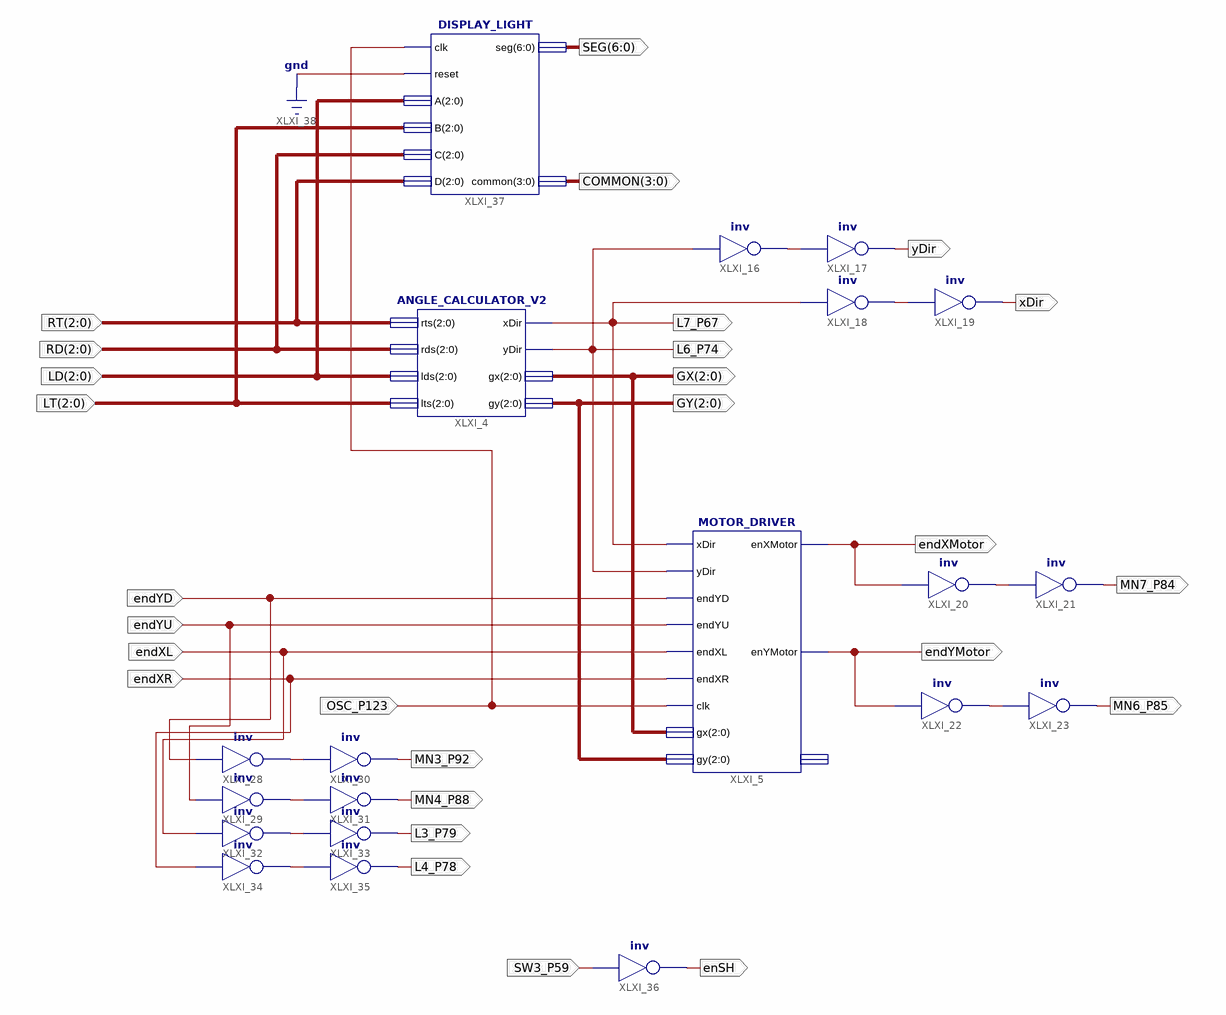
[diagram p0: schematic sheet 1]
// Xilinx ISE schematic main.sch (spartan6) as structural Verilog: 20 symbols, 27 ports
module main (
  input  [2:0] RT,
  input  [2:0] RD,
  input  [2:0] LD,
  input  [2:0] LT,
  input  OSC_P123,
  input  endYU,
  input  endXL,
  input  endXR,
  input  endYD,
  input  SW3_P59,
  output L7_P67,
  output L6_P74,
  output [2:0] GX,
  output [2:0] GY,
  output endXMotor,
  output endYMotor,
  output yDir,
  output xDir,
  output MN7_P84,
  output MN6_P85,
  output MN3_P92,
  output MN4_P88,
  output L3_P79,
  output L4_P78,
  output enSH,
  output [6:0] SEG,
  output [3:0] COMMON
);

  wire XLXN_35, XLXN_36, XLXN_37, XLXN_38, XLXN_50, XLXN_51, XLXN_52, XLXN_53;

  ANGLE_CALCULATOR_V2 XLXI_4 (.rts(RT), .rds(RD), .lds(LD), .lts(LT), .xDir(L7_P67), .yDir(L6_P74), .gx(GX), .gy(GY));
  MOTOR_DRIVER XLXI_5 (
    .xDir(L7_P67), .yDir(L6_P74), .endYD(endYD), .endYU(endYU), .endXL(endXL), .endXR(endXR), .clk(OSC_P123),
    .gx(GX), .gy(GY), .enXMotor(endXMotor), .enYMotor(endYMotor));  // open: st
  not XLXI_16 (XLXN_35, L6_P74);
  not XLXI_17 (yDir, XLXN_35);
  not XLXI_18 (XLXN_36, L7_P67);
  not XLXI_19 (xDir, XLXN_36);
  not XLXI_20 (XLXN_37, endXMotor);
  not XLXI_21 (MN7_P84, XLXN_37);
  not XLXI_22 (XLXN_38, endYMotor);
  not XLXI_23 (MN6_P85, XLXN_38);
  not XLXI_28 (XLXN_50, endYD);
  not XLXI_29 (XLXN_51, endYU);
  not XLXI_30 (MN3_P92, XLXN_50);
  not XLXI_31 (MN4_P88, XLXN_51);
  not XLXI_32 (XLXN_52, endXL);
  not XLXI_33 (L3_P79, XLXN_52);
  not XLXI_34 (XLXN_53, endXR);
  not XLXI_35 (L4_P78, XLXN_53);
  not XLXI_36 (enSH, SW3_P59);
  DISPLAY_LIGHT XLXI_37 (.clk(OSC_P123), .reset(1'b0), .A(LD), .B(LT), .C(RD), .D(RT), .seg(SEG), .common(COMMON));
endmodule
